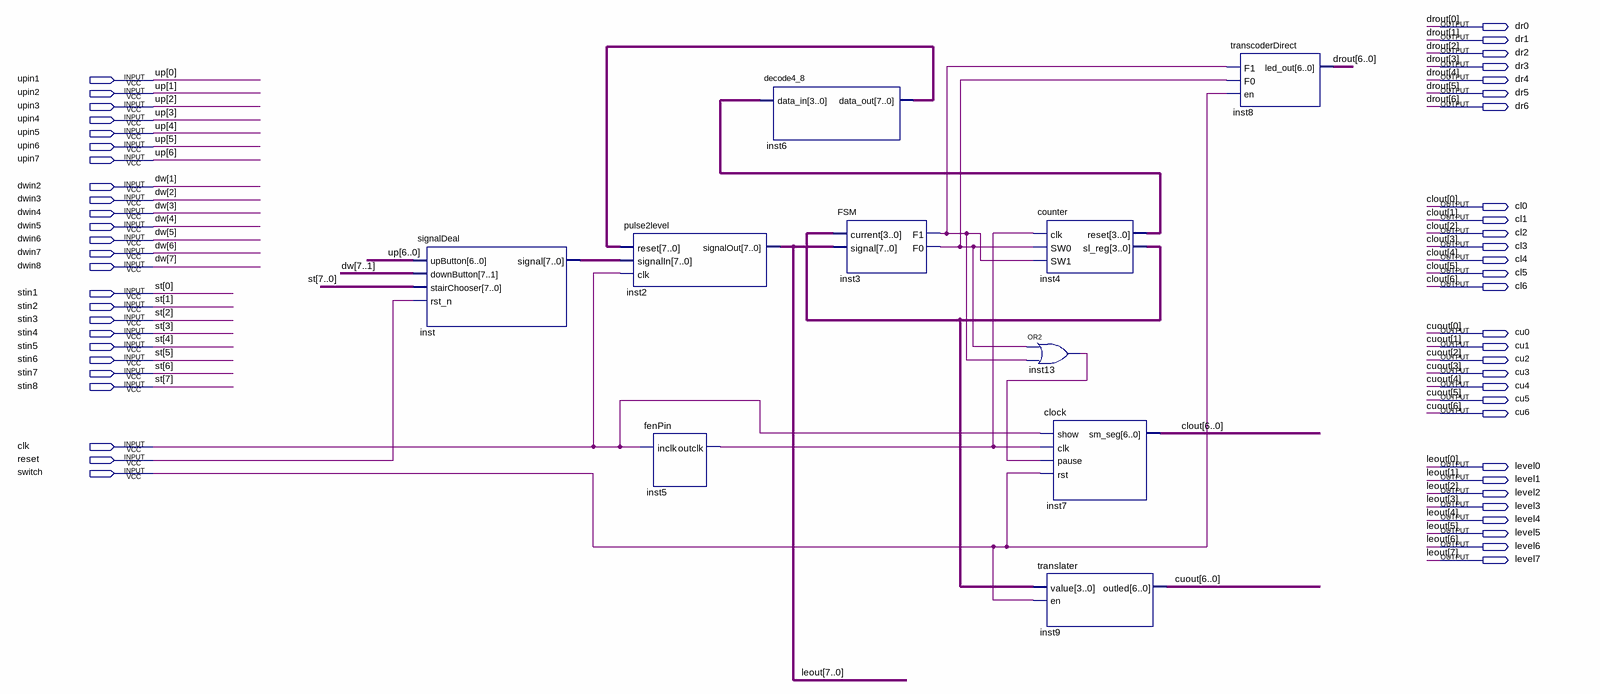
[diagram p0: schematic sheet]
// Quartus schematic elevator.bdf as structural Verilog: 10 symbols, 54 pins
module elevator (
  input  upin1,
  input  upin2,
  input  upin3,
  input  upin4,
  input  upin5,
  input  upin6,
  input  upin7,
  input  dwin2,
  input  dwin3,
  input  dwin4,
  input  dwin5,
  input  dwin6,
  input  dwin7,
  input  dwin8,
  input  stin1,
  input  stin2,
  input  stin3,
  input  stin4,
  input  stin5,
  input  stin6,
  input  stin7,
  input  stin8,
  input  clk,
  input  reset,
  input  switch,
  output dr0,
  output dr1,
  output dr2,
  output dr3,
  output dr4,
  output dr5,
  output dr6,
  output cl0,
  output cl1,
  output cl2,
  output cl3,
  output cl4,
  output cl5,
  output cl6,
  output cu0,
  output cu1,
  output cu2,
  output cu3,
  output cu4,
  output cu5,
  output cu6,
  output level0,
  output level1,
  output level2,
  output level3,
  output level4,
  output level5,
  output level6,
  output level7
);

  wire inst3_f0, inst3_f1, inst5_outclk, inst13_out;
  wire [3:0] inst4_reset, inst4_sl_reg;
  wire [7:0] inst6_data_out, inst_signal;

  signalDeal inst (
    .upButton({upin7, upin6, upin5, upin4, upin3, upin2, upin1}),
    .downButton({dwin8, dwin7, dwin6, dwin5, dwin4, dwin3, dwin2}),
    .stairChooser({stin8, stin7, stin6, stin5, stin4, stin3, stin2, stin1}), .rst_n(reset),
    .signal(inst_signal));
  pulse2level inst2 (
    .reset(inst6_data_out), .signalIn(inst_signal), .clk(clk),
    .signalOut({level7, level6, level5, level4, level3, level2, level1, level0}));
  fenPin inst5 (.inclk(clk), .outclk(inst5_outclk));
  decode4_8 inst6 (.data_in(inst4_reset), .data_out(inst6_data_out));
  FSM inst3 (
    .current(inst4_sl_reg), .signal({level7, level6, level5, level4, level3, level2, level1, level0}),
    .F1(inst3_f1), .F0(inst3_f0));
  counter inst4 (.clk(inst5_outclk), .SW0(inst3_f0), .SW1(inst3_f1), .reset(inst4_reset), .sl_reg(inst4_sl_reg));
  or inst13 (inst13_out, inst3_f0, inst3_f1);
  clock inst7 (
    .show(clk), .clk(inst5_outclk), .pause(inst13_out), .rst(switch),
    .sm_seg({cl6, cl5, cl4, cl3, cl2, cl1, cl0}));
  translater inst9 (.value(inst4_sl_reg), .en(switch), .outled({cu6, cu5, cu4, cu3, cu2, cu1, cu0}));
  transcoderDirect inst8 (.F1(inst3_f1), .F0(inst3_f0), .en(switch), .led_out({dr6, dr5, dr4, dr3, dr2, dr1, dr0}));

  // Other names for the same wires on the sheet: clout[6:0] = {cl6, cl5, cl4, cl3, cl2, cl1, cl0};
  //   cuout[6:0] = {cu6, cu5, cu4, cu3, cu2, cu1, cu0}; drout[6:0] = {dr6, dr5, dr4, dr3, dr2, dr1, dr0};
  //   dw[7:1] = {dwin8, dwin7, dwin6, dwin5, dwin4, dwin3, dwin2};
  //   leout[7:0] = {level7, level6, level5, level4, level3, level2, level1, level0};
  //   st[7:0] = {stin8, stin7, stin6, stin5, stin4, stin3, stin2, stin1};
  //   up[6:0] = {upin7, upin6, upin5, upin4, upin3, upin2, upin1}
endmodule
